# Altium schematic sheet Sheet1.SchDoc
size A4; SheetNumber: 1; SheetTotal: 1
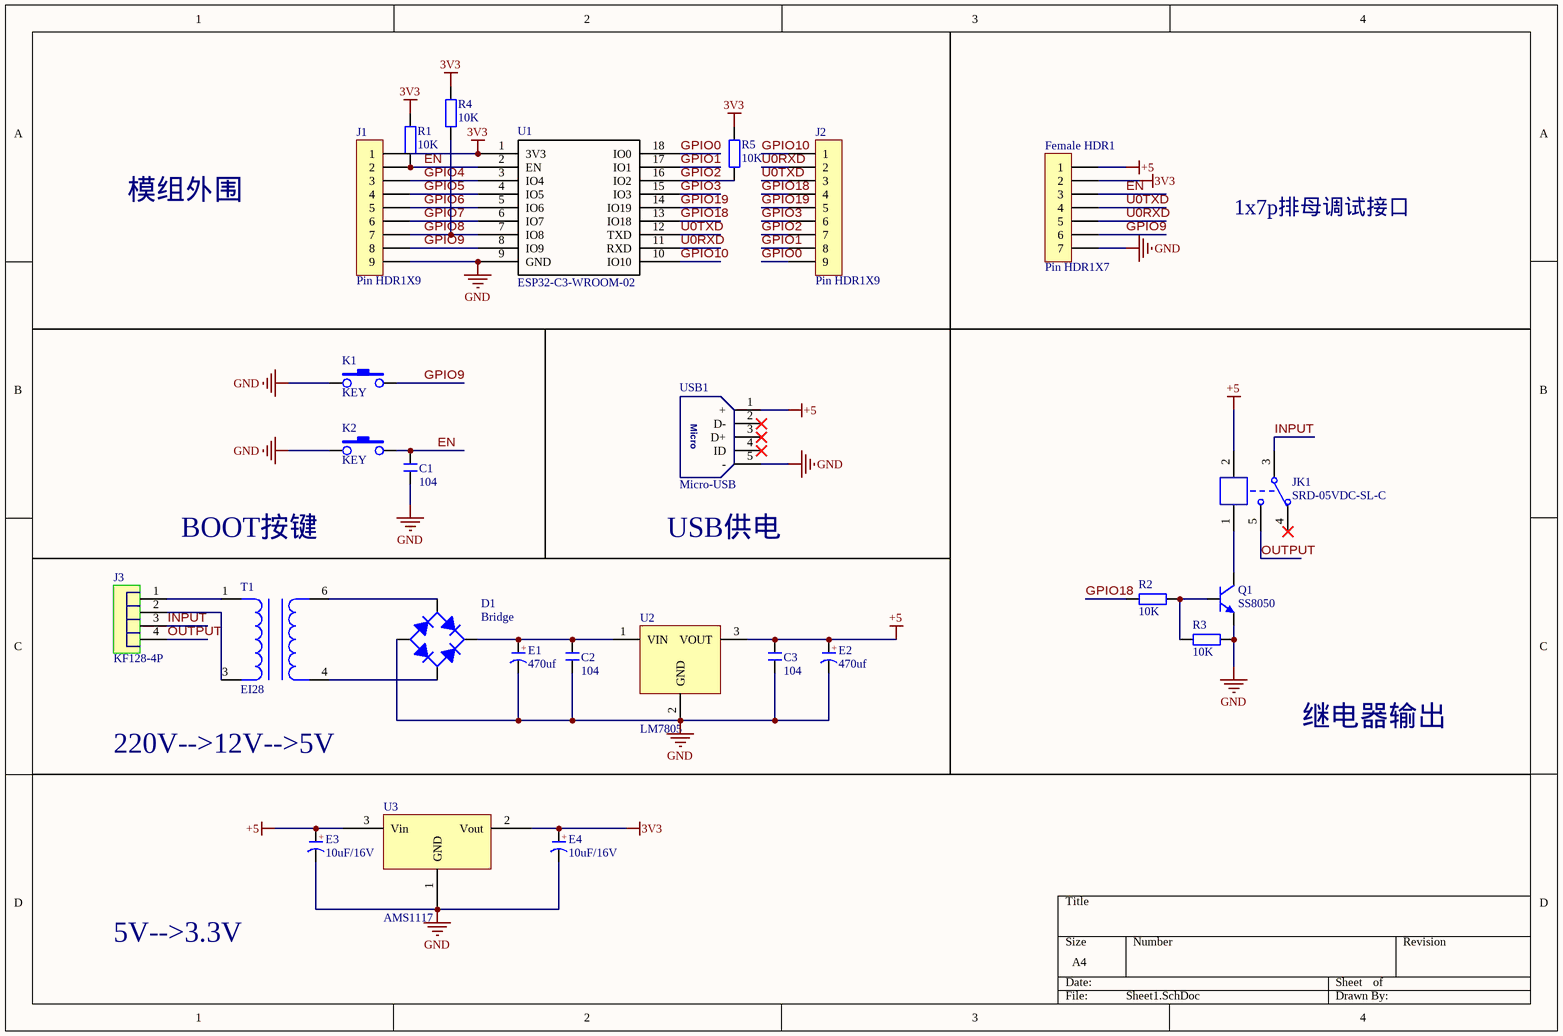
[diagram p0: Sheet1.SchDoc]

## Parts
C1  104  [CC 1.8*3.6]
C2  104  [CC 1.8*3.6]
C3  104  [CC 1.8*3.6]
D1  Bridge  [GBP]
E1  470uf  [CAP 1.5*4*8]
E2  470uf  [CAP 1.5*4*8]
E3  10uF/16V  [CAP 1.5*4*8]
E4  10uF/16V  [CAP 1.5*4*8]
Female_HDR1  Pin HDR1X7  [Pin HDR1X7/2.54mm-W]
J1  Pin HDR1X9  [Pin HDR1X9/2.54mm-W]
J2  Pin HDR1X9  [Pin HDR1X9/2.54mm-W]
J3  KF128-4P  [KF128-3.81-4P]
JK1  SRD-05VDC-SL-C  [SRD-C_B]
K1  KEY  [DIP-3X6X4.3]
K2  KEY  [DIP-3X6X4.3]
Q1  SS8050  [SOT23-3N]
R1  10K  [RS 1/4W]
R2  10K  [RS 1/4W]
R3  10K  [RS 1/4W]
R4  10K  [RS 1/4W]
R5  10K  [RS 1/4W]
T1  EI28  [DA10XC]
U1  ESP32­C3­WROOM­02  [ESP32C3]
U2  LM7805  [TO220A]
U3  AMS1117  [SOT223]
USB1  Micro-USB  [USB-MICRO_A]

## Nets
3V3: E4.1(A) Female_HDR1.2 J1.1 R1.2 R4.2 R5.2 U1.1(3V3) U3.2(Vout)
+5: C3.1 E2.1(A) E3.1(A) Female_HDR1.1 JK1.2 U2.3(VOUT) U3.3(Vin) USB1.1(+)
GND: C1.2 C2.2 C3.2 D1.DC- E1.2(K) E2.2(K) E3.2(K) E4.2(K) Female_HDR1.7 J1.9 K1.1 K2.1 Q1.2(E) R3.2 U1.9(GND) U2.2(GND) U3.1(GND) USB1.5(-)
EN: C1.1 Female_HDR1.3 J1.2 K2.3 R1.1 U1.2(EN)
GPIO0: J2.9 U1.18(IO0)
GPIO1: J2.8 U1.17(IO1)
GPIO2: J2.7 R5.1 U1.16(IO2)
GPIO3: J2.6 U1.15(IO3)
GPIO4: J1.3 U1.3(IO4)
GPIO5: J1.4 U1.4(IO5)
GPIO6: J1.5 U1.5(IO6)
GPIO7: J1.6 U1.6(IO7)
GPIO8: J1.7 R4.1 U1.7(IO8)
GPIO9: Female_HDR1.6 J1.8 K1.3 U1.8(IO9)
GPIO10: J2.1 U1.10(IO10)
GPIO18: J2.4 R2.1 U1.13(IO18)
GPIO19: J2.5 U1.14(IO19)
INPUT: J3.3 JK1.3
OUTPUT: J3.4 JK1.5
U0RXD: Female_HDR1.5 J2.2 U1.11(RXD)
U0TXD: Female_HDR1.4 J2.3 U1.12(TXD)
NetC2_1: C2.1 D1.DC+ E1.1(A) U2.1(VIN)
NetD1_AC1: D1.AC1 T1.6
NetD1_AC2: D1.AC2 T1.4
NetJ3_1: J3.1 T1.1
NetJ3_2: J3.2 T1.3
NetJK1_1: JK1.1 Q1.3(C)
NetQ1_1: Q1.1(B) R2.2 R3.1

Not connected (* = marked no-connect by the designer): JK1 4*; USB1 2(D-)* 3(D+)* 4(ID)*

## Notes on the sheet
- 模组外围
- 1x7p排母调试接口
- BOOT按键
- (near USB1) USB供电
- (near T1) 220V-->12V-->5V
- 继电器输出
- 5V-->3.3V
- (in symbol C-CAP) +
- (in symbol Micro-USB) Micro

## Library data of the parts
C1-C3 = C-CC: 直插瓷片电容; 版权归属: 源创客; BOM名称: 直插瓷片电容; 学习资源: www.ooocke.com
E1-E4 = C-CAP: 直插电解电容; 版权归属: 源创客; BOM名称: 直插电解电容; 学习资源: www.ooocke.com
JK1 = SRD-05VDC-SL-C: 5V一组转换
Q1 = 8050-SMD: 高频放大-NPN型; 版权归属: 源创客; 属性: 40V 1.5A 1W 100MHZ; BOM名称: 高频放大-NPN型; 学习资源: www.ooocke.com
R1-R5 = R-CRR: 直插色环电阻; BOM名称: 色环电阻; 版权归属: 源创客; 学习资源: www.ooocke.com
T1 = DA10XC: EI28卧式1.2W220V转12V工频PCB线路板直插针式小型变压器单相交流; ROM名称: 数字隔离变压器; 版权归属: 源创客; 学习资源: www.ooocke.com
U1 = ESP32­C3­WROOM­02: ESP32-C3模块
U3 = AMS1117: 三端稳压芯片